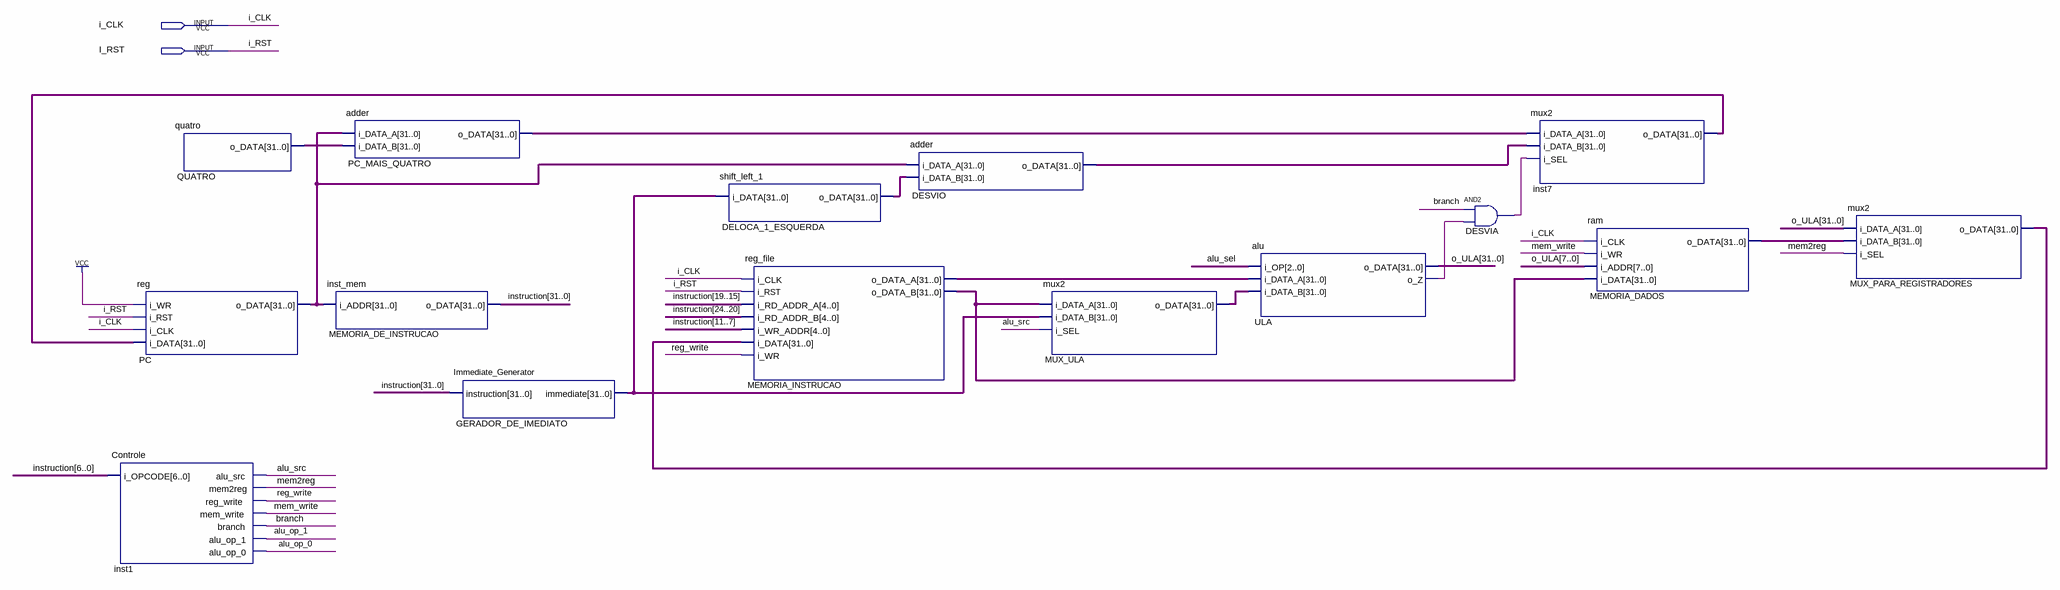
[diagram p0: schematic sheet]
// Quartus schematic RISC_V_monociclo.bdf as structural Verilog: 15 symbols, 2 pins
module RISC_V_monociclo (
  input  i_CLK,
  input  I_RST
);

  wire alu_op_0, alu_op_1, alu_sel, alu_src, branch, DESVIA_out, mem2reg, mem_write, reg_write, ULA_o_z;
  wire [31:0] DELOCA_1_ESQUERDA_o_data, DESVIO_o_data, GERADOR_DE_IMEDIATO_immediate, inst7_o_data,
       instruction, MEMORIA_DADOS_o_data, MEMORIA_INSTRUCAO_o_data_a, MEMORIA_INSTRUCAO_o_data_b,
       MUX_PARA_REGISTRADORES_o_data, MUX_ULA_o_data, o_ULA, PC_MAIS_QUATRO_o_data, PC_o_data, QUATRO_o_data;

  Controle inst1 (
    .i_OPCODE(instruction[6:0]), .alu_src(alu_src), .mem2reg(mem2reg), .reg_write(reg_write),
    .mem_write(mem_write), .branch(branch), .alu_op_1(alu_op_1), .alu_op_0(alu_op_0));
  \reg  PC (.i_WR(1'b1), .i_RST(I_RST), .i_CLK(i_CLK), .i_DATA(inst7_o_data), .o_DATA(PC_o_data));
  quatro QUATRO (.o_DATA(QUATRO_o_data));
  adder PC_MAIS_QUATRO (.i_DATA_A(PC_o_data), .i_DATA_B(QUATRO_o_data), .o_DATA(PC_MAIS_QUATRO_o_data));
  inst_mem MEMORIA_DE_INSTRUCAO (.i_ADDR(PC_o_data), .o_DATA(instruction));
  Immediate_Generator GERADOR_DE_IMEDIATO (.instruction(instruction), .immediate(GERADOR_DE_IMEDIATO_immediate));
  shift_left_1 DELOCA_1_ESQUERDA (.i_DATA(GERADOR_DE_IMEDIATO_immediate), .o_DATA(DELOCA_1_ESQUERDA_o_data));
  reg_file MEMORIA_INSTRUCAO (
    .i_CLK(i_CLK), .i_RST(I_RST), .i_RD_ADDR_A(instruction[19:15]), .i_RD_ADDR_B(instruction[24:20]),
    .i_WR_ADDR(instruction[11:7]), .i_DATA(MUX_PARA_REGISTRADORES_o_data), .i_WR(reg_write),
    .o_DATA_A(MEMORIA_INSTRUCAO_o_data_a), .o_DATA_B(MEMORIA_INSTRUCAO_o_data_b));
  adder DESVIO (.i_DATA_A(PC_o_data), .i_DATA_B(DELOCA_1_ESQUERDA_o_data), .o_DATA(DESVIO_o_data));
  mux2 MUX_ULA (
    .i_DATA_A(MEMORIA_INSTRUCAO_o_data_b), .i_DATA_B(GERADOR_DE_IMEDIATO_immediate), .i_SEL(alu_src),
    .o_DATA(MUX_ULA_o_data));
  alu ULA (
    .i_OP({3{alu_sel}}), .i_DATA_A(MEMORIA_INSTRUCAO_o_data_a), .i_DATA_B(MUX_ULA_o_data), .o_DATA(o_ULA),
    .o_Z(ULA_o_z));
  and DESVIA (DESVIA_out, branch, ULA_o_z);
  mux2 inst7 (.i_DATA_A(PC_MAIS_QUATRO_o_data), .i_DATA_B(DESVIO_o_data), .i_SEL(DESVIA_out), .o_DATA(inst7_o_data));
  ram MEMORIA_DADOS (
    .i_CLK(i_CLK), .i_WR(mem_write), .i_ADDR(o_ULA[7:0]), .i_DATA(MEMORIA_INSTRUCAO_o_data_b),
    .o_DATA(MEMORIA_DADOS_o_data));
  mux2 MUX_PARA_REGISTRADORES (
    .i_DATA_A(o_ULA), .i_DATA_B(MEMORIA_DADOS_o_data), .i_SEL(mem2reg), .o_DATA(MUX_PARA_REGISTRADORES_o_data));
endmodule
